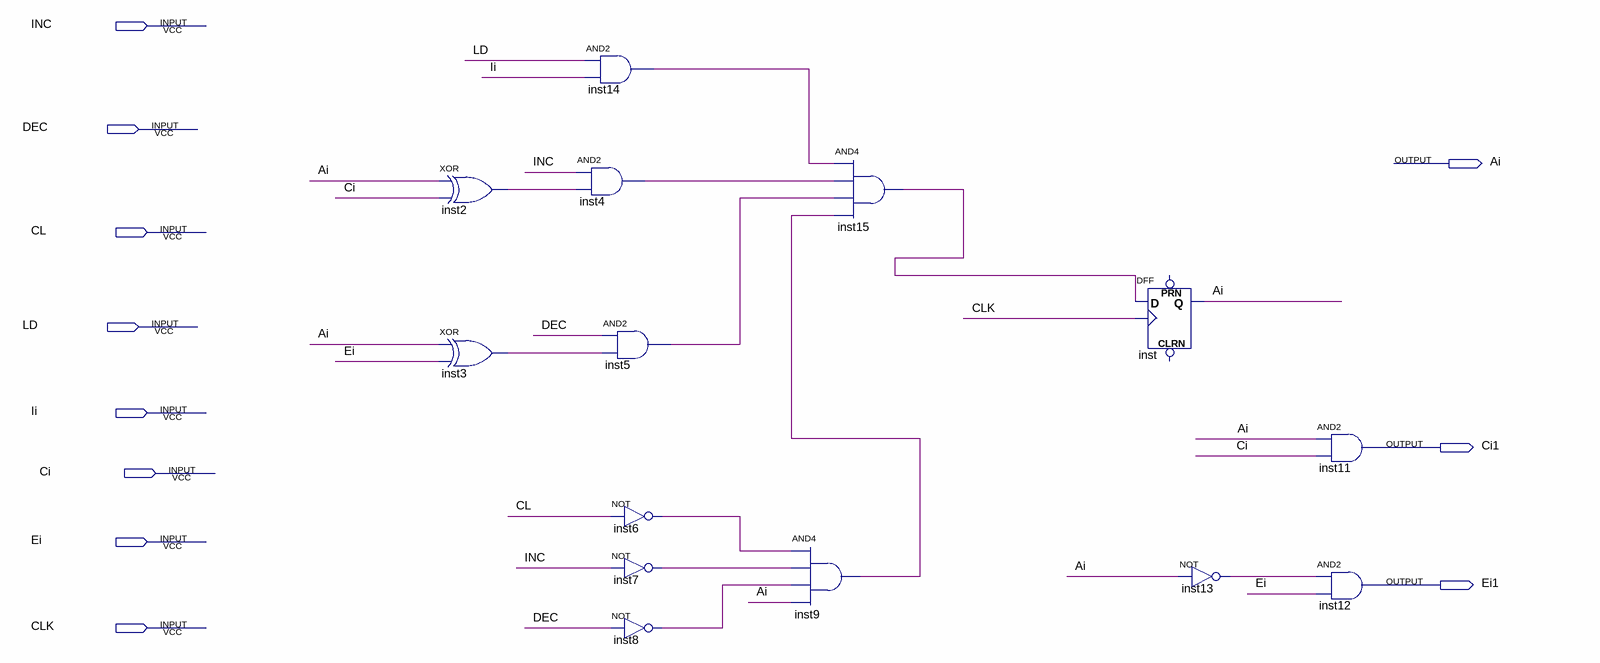
[diagram p0: schematic sheet]
// Quartus schematic REG1_LD_CL_INC_DEC.bdf as structural Verilog: 14 symbols, 11 pins
module REG1_LD_CL_INC_DEC (
  input  INC,
  input  DEC,
  input  CL,
  input  LD,
  input  Ii,
  input  Ci,
  input  Ei,
  input  CLK,
  output Ai,
  output Ci1,
  output Ei1
);

  wire inst2_out, inst3_out, inst4_out, inst5_out, inst6_out, inst7_out, inst8_out, inst9_out, inst13_out,
       inst14_out, inst15_out;

  xor inst2 (inst2_out, Ai, Ci);
  xor inst3 (inst3_out, Ai, Ei);
  and inst14 (inst14_out, LD, Ii);
  and inst4 (inst4_out, INC, inst2_out);
  and inst5 (inst5_out, DEC, inst3_out);
  not inst6 (inst6_out, CL);
  not inst7 (inst7_out, INC);
  not inst8 (inst8_out, DEC);
  and inst9 (inst9_out, inst6_out, inst7_out, inst8_out, Ai);
  and inst15 (inst15_out, inst14_out, inst4_out, inst5_out, inst9_out);
  DFF inst (.CLK(CLK), .D(inst15_out), .Q(Ai));  // open: CLRN, PRN
  not inst13 (inst13_out, Ai);
  and inst11 (Ci1, Ai, Ci);
  and inst12 (Ei1, inst13_out, Ei);
endmodule
